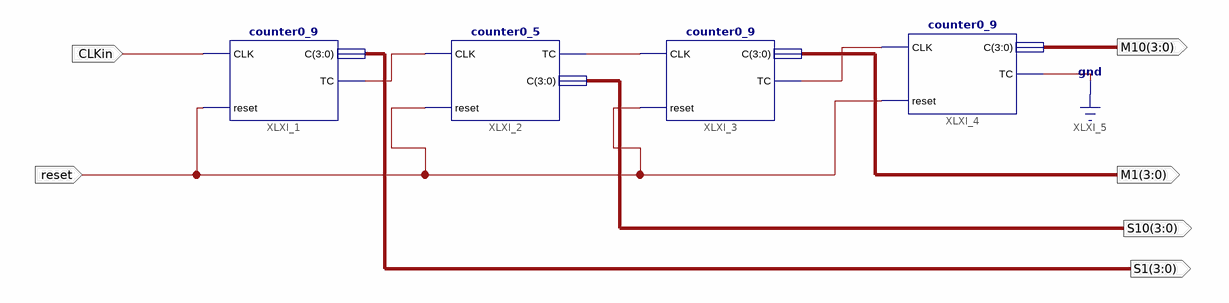
[diagram p0: schematic sheet 1]
// Xilinx ISE schematic counter.sch (spartan6) as structural Verilog: 4 symbols, 6 ports
module counter (
  input  CLKin,
  input  reset,
  output [3:0] M10,
  output [3:0] M1,
  output [3:0] S10,
  output [3:0] S1
);

  wire XLXN_2, XLXN_3, XLXN_4;

  counter0_9 XLXI_1 (.reset(reset), .CLK(CLKin), .C(S1), .TC(XLXN_2));
  counter0_5 XLXI_2 (.CLK(XLXN_2), .reset(reset), .C(S10), .TC(XLXN_3));
  counter0_9 XLXI_3 (.reset(reset), .CLK(XLXN_3), .C(M1), .TC(XLXN_4));
  counter0_9 XLXI_4 (.reset(reset), .CLK(XLXN_4), .C(M10), .TC(1'b0));
endmodule
